# Altium project Altium_project.PrjPcb
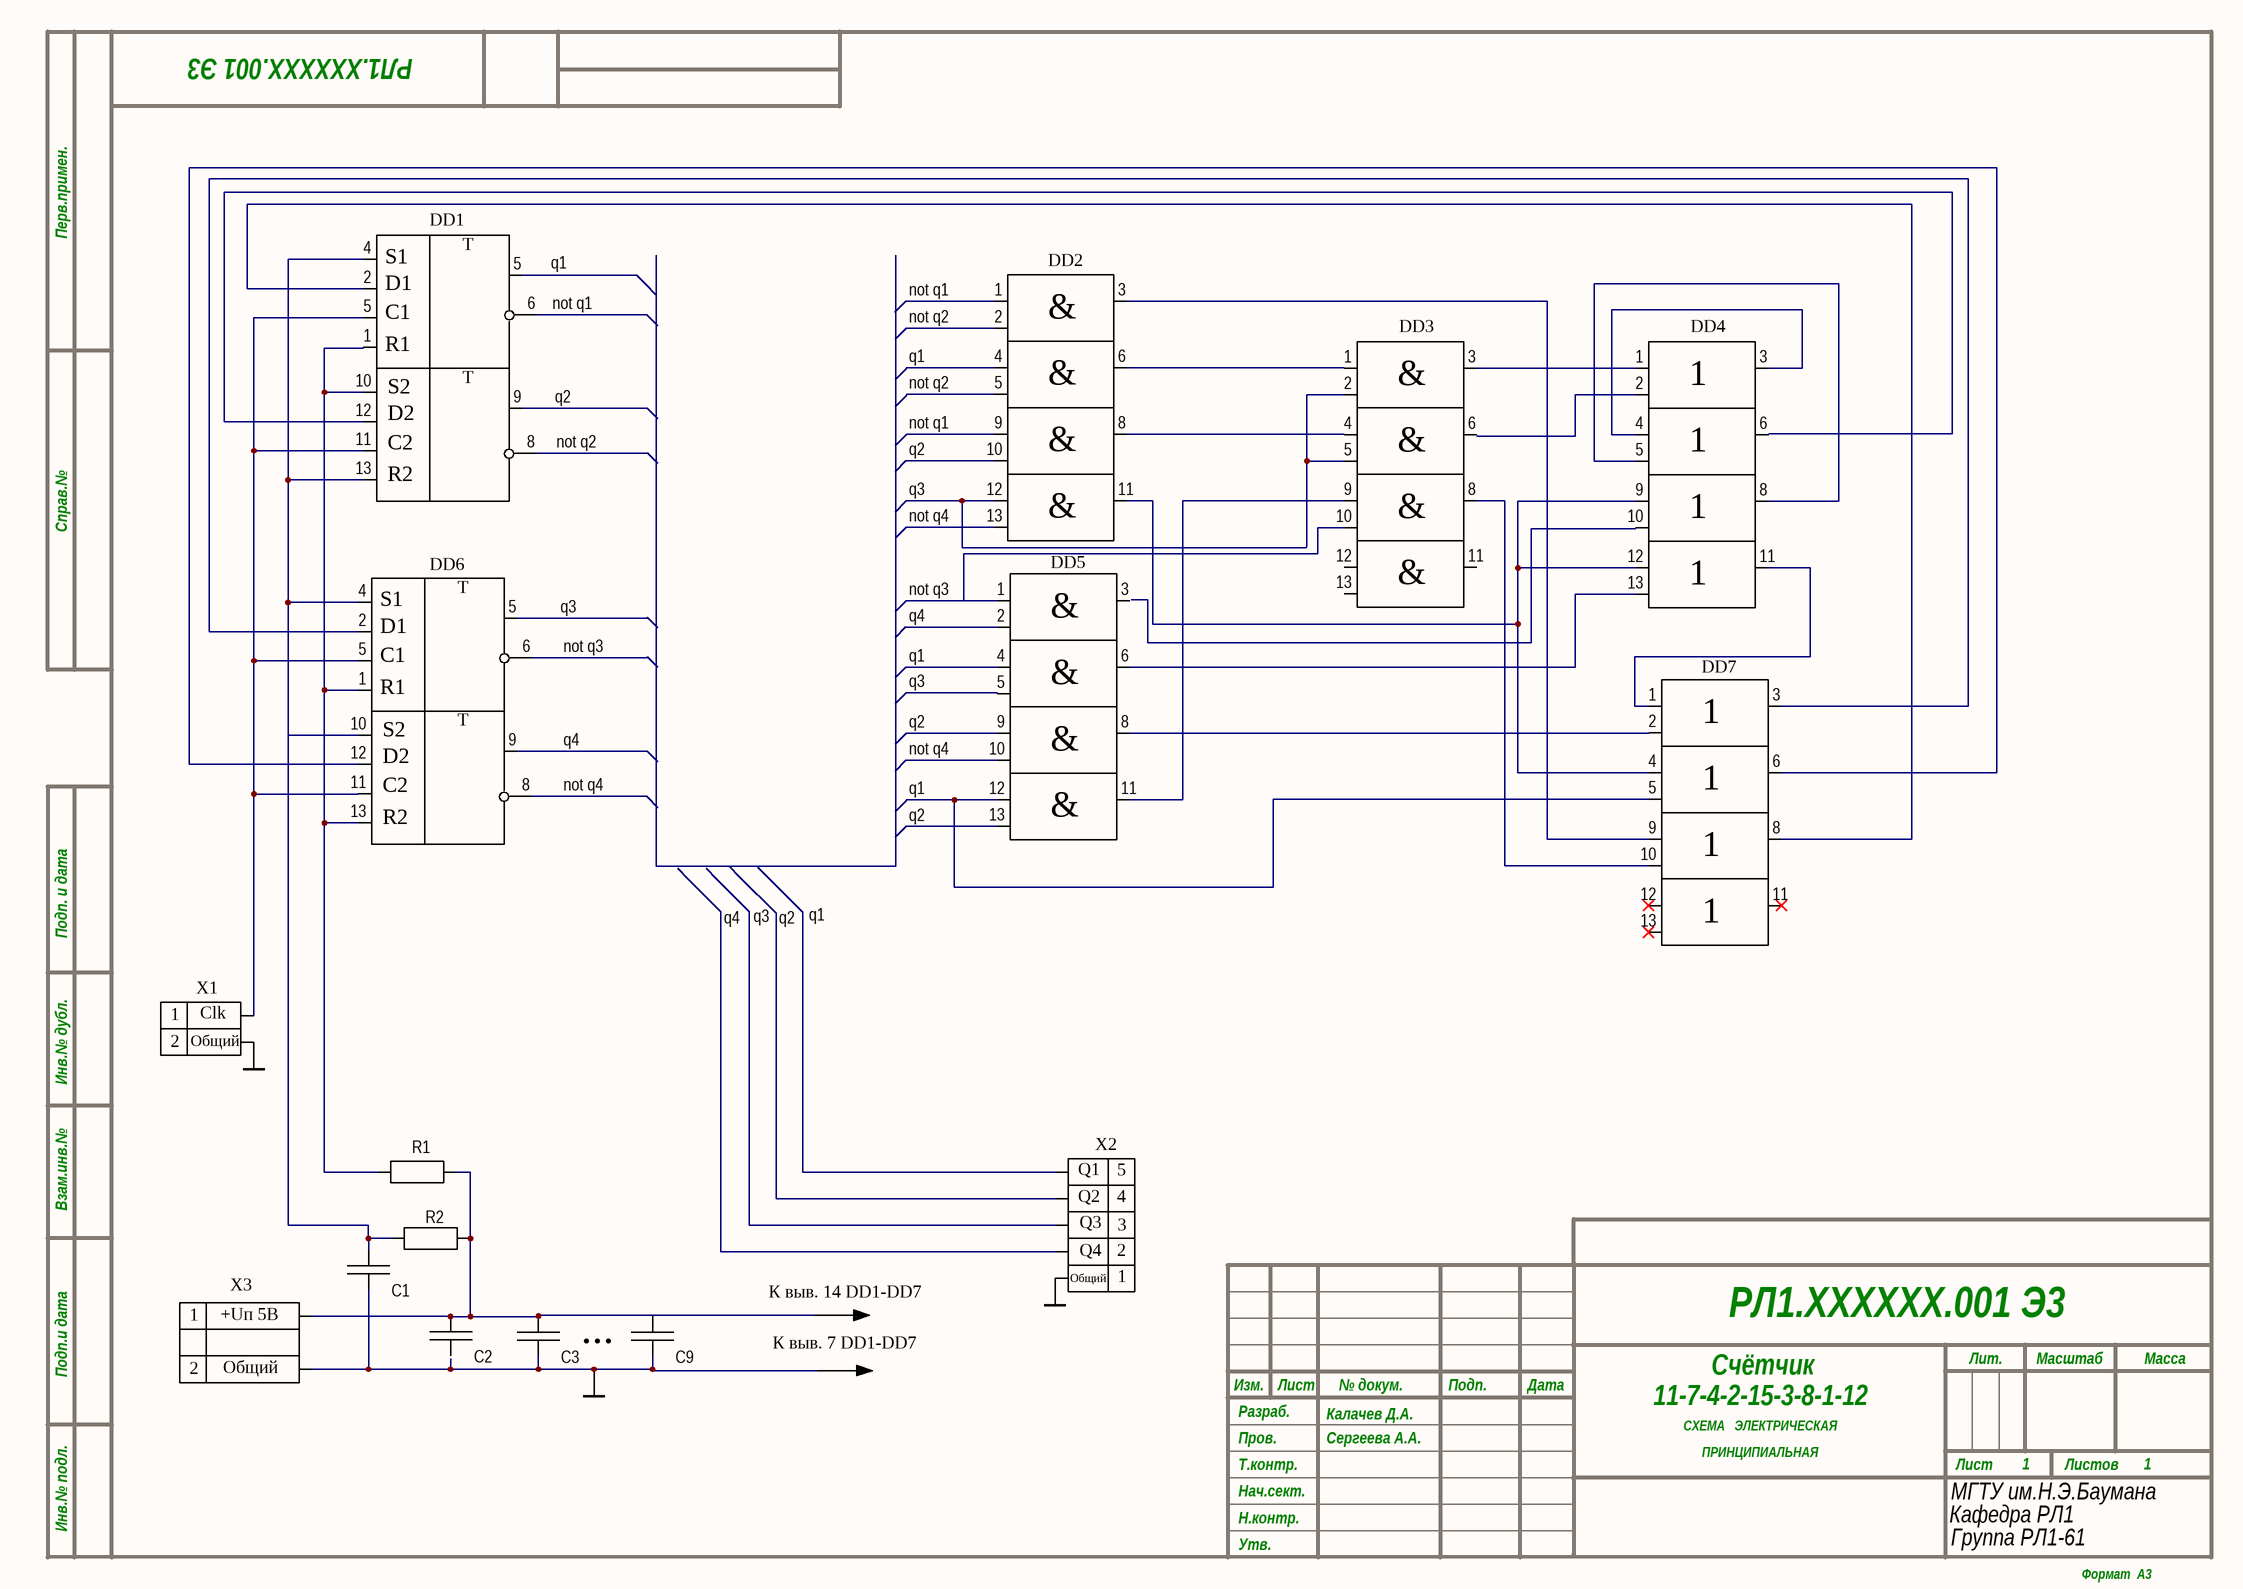
[diagram p0: circuitDiagramA3.SchDoc]
1 sheet, 18 parts. Net scope: global (net labels, ports and power ports of the same name join across sheets).

## Sheet circuitDiagramA3.SchDoc
size 420 x 297 mm; CheckedBy: Сергеева А.А.; Author: Калачев Д.А.; Address1: МГТУ им.Н.Э.Баумана; Address2: Кафедра РЛ1; Address3: Группа РЛ1-61; SheetNumber: 1; SheetTotal: 1; AA_RazrabName: Калачев Д.А.; AA_Prov: Глотов. А.Н.; Name1: Счётчик; Name2: 11-7-4-2-15-3-8-1-12; DecimalNumber: РЛ1.XXXXXX.001

### Parts
1  К выв. 14 DD1-DD7
2  К выв. 7 DD1-DD7
C1  К10-17Б-М47-1 мкФ ±10% В ОЖО.460.172 ТУ  (value not drawn)
C2  К10-17Б-М47-1 мкФ ±10% В ОЖО.460.172 ТУ  (value not drawn)
C3  К10-17Б-М47-1 мкФ ±10% В ОЖО.460.172 ТУ  (value not drawn)
C9  К10-17Б-М47-1 мкФ ±10% В ОЖО.460.172 ТУ  (value not drawn)
DD1  КР1533ТМ2  (value not drawn)
DD2  КР1533ЛИ1  (value not drawn)
DD3  КР1533ЛИ1  (value not drawn)
DD4  КР1533ЛЛ1  (value not drawn)
DD5  КР1533ЛИ1  (value not drawn)
DD6  КР1533ТМ2  (value not drawn)
DD7  КР1533ЛЛ1  (value not drawn)
R1  Резистор С1-4-0,25-1 кОм ±5% АПШК.434110.001 ТУ  (value not drawn)
R2  Резистор С1-4-0,25-1 кОм ±5% АПШК.434110.001 ТУ  (value not drawn)
X1  СР50-73ФВ  (value not drawn)
X2  DB9F  (value not drawn)
X3  DS-213B  (value not drawn)

### Nets
GND: C1.1 C3.1 C9.1 X1.14 X2.14 X3.14
not q1: DD1.6(not_Q) DD2.1 DD2.9
not q2: DD1.8(not_Q) DD2.2 DD2.5
not q3: DD5.1 DD6.6(not_Q)
not q4: DD2.13 DD5.10 DD6.8(not_Q)
q1: DD2.4 DD5.4 DD5.12 DD7.5
q2: DD1.9(Q) DD2.10 DD5.9 DD5.13
q3: DD2.12 DD3.2 DD3.5 DD5.5 DD6.5(Q)
q4: DD5.2 DD6.9(Q)
NetC1_2: C1.2 DD1.4 DD1.13 DD6.4 R2.1
NetC2_2: C2.2 C3.2 R1.2 R2.2 X3.14
NetDD1_1: DD1.1 DD1.10 DD6.1 DD6.13 R1.1
NetDD1_2: DD1.2 DD7.8
NetDD1_5: DD1.5(Q) DD1.11 DD6.5 DD6.11 X1.14
NetDD2_3: DD2.3 DD7.9
NetDD2_6: DD2.6 DD3.1
NetDD2_8: DD2.8 DD3.4
NetDD2_11: DD2.11 DD4.9 DD4.12 DD7.4
NetDD3_3: DD3.3 DD4.1
NetDD3_8: DD3.8 DD7.10
NetDD3_9: DD3.9 DD5.11
NetDD4_3: DD4.3 DD4.4
NetDD4_5: DD4.5 DD4.8
NetDD4_11: DD4.11 DD7.1
NetDD4_13: DD4.13 DD5.6
NetDD5_8: DD5.8 DD7.2
NetDD6_2: DD6.2 DD7.3
NetDD6_12: DD6.12 DD7.6

Not connected (* = marked no-connect by the designer): C2 1; C9 2; DD1 12(4); DD3 6(20) 10 11 12 13; DD4 2(16) 6(20) 10; DD5 3(17); DD6 10(3); DD7 11* 12* 13*

### Notes on the sheet
- (near C9) ...
- Labels drawn without touching a wire or pin: q1, q2, q3, q4
- Перв.примен.
- Справ.№
- Подп. и дата
- Инв.№ дубл.
- Взам.инв.№
- Подп.и дата
- Разраб.
- Изм.
- Лист
- № докум.
- Подп.
- Дата
- Лит.
- Масштаб
- Масса
- Т.контр.
- Пров.
- СХЕМА   ЭЛЕКТРИЧЕСКАЯ
- ПРИНЦИПИАЛЬНАЯ
- Листов
- Инв.№ подл.
- Утв.
- Н.контр.
- Нач.сект.
- Формат  A3
- (in symbol DB9F) Q1; 5; Q2; 4; Q3; 3; Q4; 2; Общий; 1
- (in symbol DS-213B) 1; +Uп 5В; 2; Общий
- (in symbol КР1533ЛИ1) &
- (in symbol КР1533ТМ2) T; S1; D1; C1; R1; S2; D2; C2; R2
- (in symbol СР50-73ФВ) 1; Clk; 2; Общий

### Library data of the parts
1 2 = power
C1-C3 C9 = C 1 мкФ
R1 R2 = R 1кОм